# EAGLE design Hydrometer (EAGLE 7.5.0)
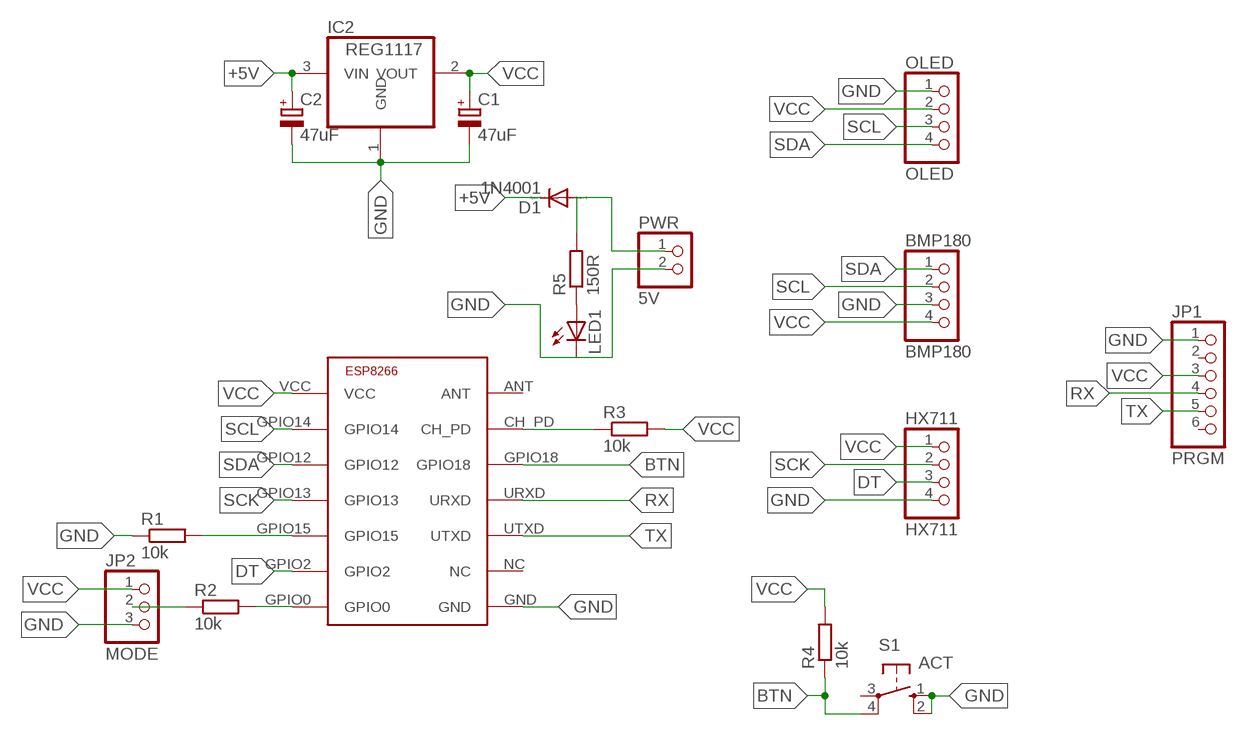
[diagram p0: schematic, sheet 1]

## Parts
BMP180  BMP180  PINHD-1X4  [1X04]
C1  47uF  CPOL-EUE2-5  [E2-5]
C2  47uF  CPOL-EUE2.5-5  [E2,5-5]
D1  1N4001  1N4004  [DO41-10]
HX711  HX711  PINHD-1X4  [1X04]
IC2  REG1117  [SOT223]
JP1  PRGM  PINHD-1X6  [1X06]
JP2  MODE  PINHD-1X3  [1X03]
LED1  LED3MM  [LED3MM]
OLED  OLED  PINHD-1X4  [1X04]
PWR  5V  PINHD-1X2  [1X02]
R1  10k  R-EU_R1206  [R1206]
R2  10k  R-EU_0204/7  [0204/7]
R3  10k  R-EU_R1206  [R1206]
R4  10k  R-EU_R1206  [R1206]
R5  150R  R-EU_0204/7  [0204/7]
S1  ACT  10-XX  [B3F-10XX]
U$1  ESP8266-03  [ESP-03]

## Nets
+5V: C2.+ D1.C IC2.3(VIN)
BTN: R4.1 S1.4(P1) U$1.GPIO18
DT: HX711.3 U$1.GPIO2
DTR: R2.2 U$1.GPIO0
GND: BMP180.3 C1.- C2.- HX711.4 IC2.1(GND) JP1.1 JP2.3 LED1.K(C) OLED.1 PWR.2 R1.1 S1.1(S) S1.2(S1) U$1.GND
N$2: JP2.2 R2.1
N$3: R1.2 U$1.GPIO15
N$4: D1.A PWR.1 R5.2
N$5: R3.1 U$1.CH_PD
N$8: LED1.A R5.1
RX: JP1.4 U$1.URXD
SCK: HX711.2 U$1.GPIO13
SCL: BMP180.2 OLED.3 U$1.GPIO14
SDA: BMP180.1 OLED.4 U$1.GPIO12
TX: JP1.5 U$1.UTXD
VCC: BMP180.4 C1.+ HX711.1 IC2.2(VOUT) JP1.3 JP2.1 OLED.2 R3.2 R4.2 U$1.VCC
Unconnected: JP1.2 JP1.6 S1.3(P) U$1.ANT U$1.NC

## Library data of the parts
BMP180 HX711 OLED = pinhead:PINHD-1X4: PIN HEADER
C1 C2 = resistor:CPOL-EU: POLARIZED CAPACITOR, European symbol
D1 = diode:1N4004: DIODE general purpose rectifier, 1 A
IC2 = burr-brown:REG1117: 800mA and 1A Low Dropout (LDO) Positive Regulator 1.8V, 2.5V, 2.85V, 3.3V, 5V, and Adj; MPN: REG1117; OC_FARNELL: 1097566; OC_NEWARK: 14P6981
JP1 = pinhead:PINHD-1X6: PIN HEADER
JP2 = pinhead:PINHD-1X3: PIN HEADER
LED1 = led:LED: LED OSRAM: - CHIPLED LG R971, LG N971, LY N971, LG Q971, LY Q971, LO R971, LY R971 LH N974, LH R974 LS Q976, LO Q976, LY Q976 LO Q996 - Hyper CHIPLED LW Q18S LB Q993, LB Q99A, LB R99A - SideLED LS A670, LO A670, LY A670, LG A670, LP A670 LB A673, LV A673, LT A673, LW A673 LH A674 LY A675 LS A676, LA A676, LO A676, LY A676, LW A676 LS A679, LY A679, LG A679 - Hyper Micro SIDELED® LS Y876, LA Y876, LO Y876, LY Y876 LT Y87S - SmartLED LW L88C, LW L88S LB L89C, LB L89S, LG L890 LS L89K, LO L89K, LY L89K LS L896, LA L896, LO L896, LY L896 - TOPLED LS T670, LO T670, LY T670, LG T670, LP T670 LSG T670, LSP T670, LSY T670, LOP T670, LYG T670 LG T671, LOG T671, LSG T671 LB T673, LV T673, LT T673, LW T673 LH T674 LS T676, LA T676, LO T676, LY T676, LB T676, LH T676, LSB T676, LW T676 LB T67C, LV T67C, LT T67C, LS T67K, LO T67K, LY T67K, LW E67C LS E67B, LA E67B, LO E67B, LY E67B, LB E67C, LV E67C, LT E67C LW T67C LS T679, LY T679, LG T679 LS T770, LO T770, LY T770, LG T770, LP T770 LB T773, LV T773, LT T773, LW T773 LH T774 LS E675, LA E675, LY E675, LS T675 LS T776, LA T776, LO T776, LY T776, LB T776 LHGB T686 LT T68C, LB T68C - Hyper Mini TOPLED® LB M676 - Mini TOPLED Santana® LG M470 LS M47K, LO M47K, LY M47K Source: http://www.osram.convergy.de LUXEON: - LUMILED® LXK2-PW12-R00, LXK2-PW12-S00, LXK2-PW14-U00, LXK2-PW14-V00 LXK2-PM12-R00, LXK2-PM12-S00, LXK2-PM14-U00 LXK2-PE12-Q00, LXK2-PE12-R00, LXK2-PE12-S00, LXK2-PE14-T00, LXK2-PE14-U00 LXK2-PB12-K00, LXK2-PB12-L00, LXK2-PB12-M00, LXK2-PB14-N00, LXK2-PB14-P00, LXK2-PB14-Q00 LXK2-PR12-L00, LXK2-PR12-M00, LXK2-PR14-Q00, LXK2-PR14-R00 LXK2-PD12-Q00, LXK2-PD12-R00, LXK2-PD12-S00 LXK2-PH12-R00, LXK2-PH12-S00 LXK2-PL12-P00, LXK2-PL12-Q00, LXK2-PL12-R00 Source: www.luxeon.com KINGBRIGHT: KA-3528ASYC Source: www.kingbright.com
PWR = pinhead:PINHD-1X2: PIN HEADER
R1-R5 = resistor:R-EU_: RESISTOR, European symbol
S1 = switch-omron:10-XX: OMRON SWITCH; MPN: B3F-1000; OC_FARNELL: 176432; OC_NEWARK: 36M3542
U$1 = ESP8200:ESP8266-03: ESP8266 - ESP-03 Module

## Net classes
0 default: width 0.001 mm

## Board
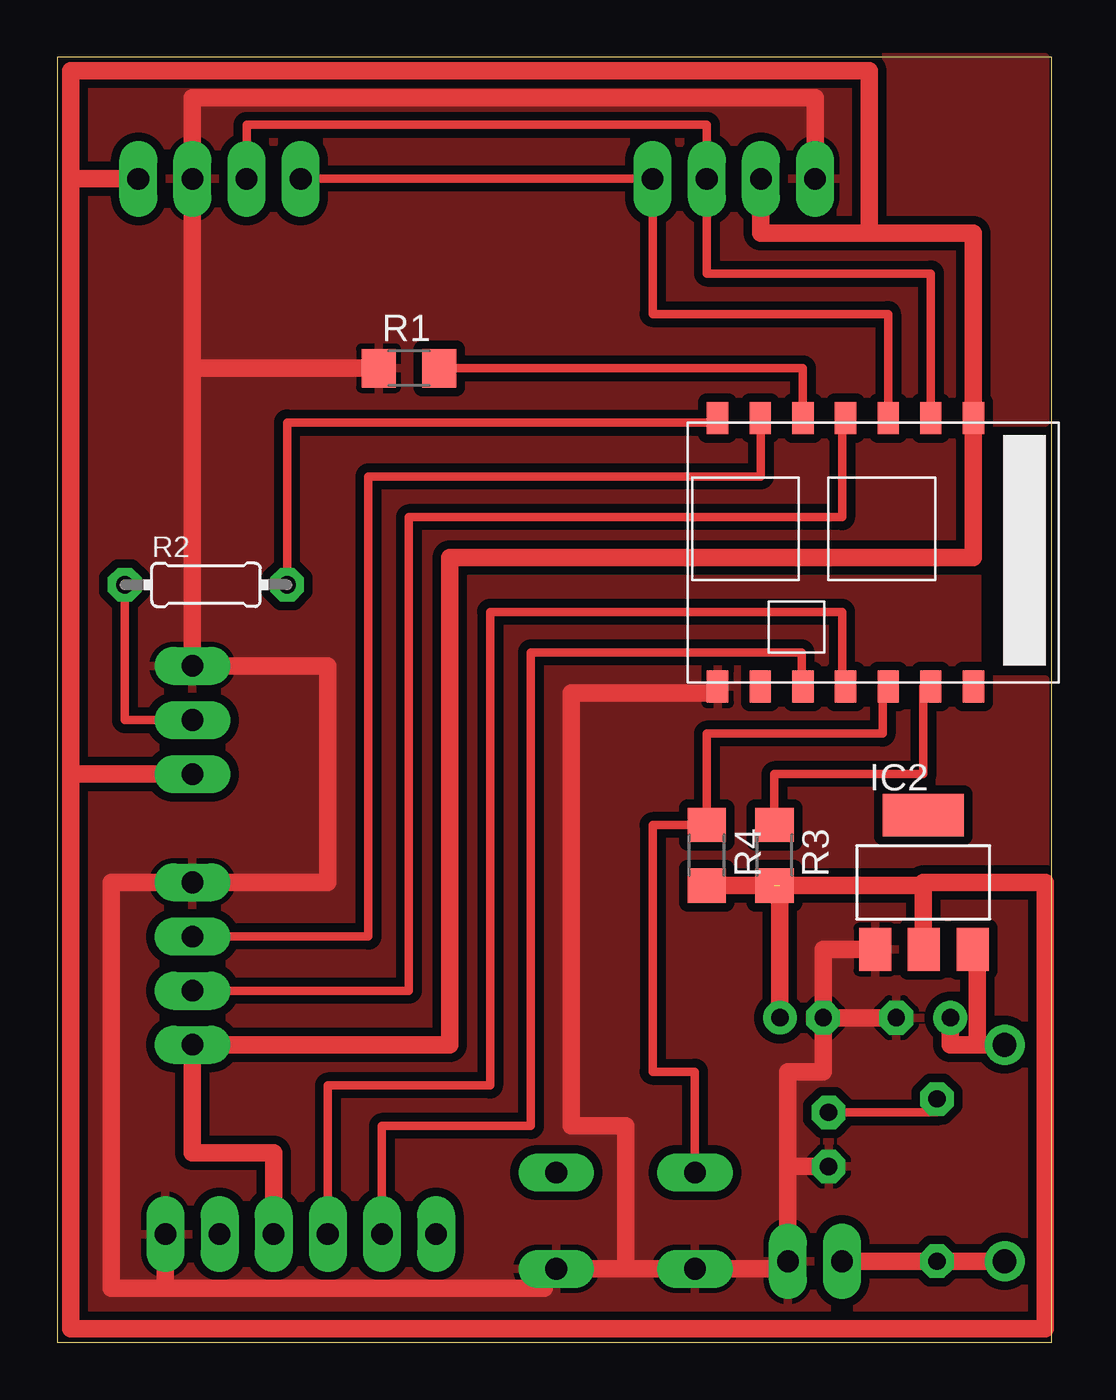
[diagram p1: board, top side]
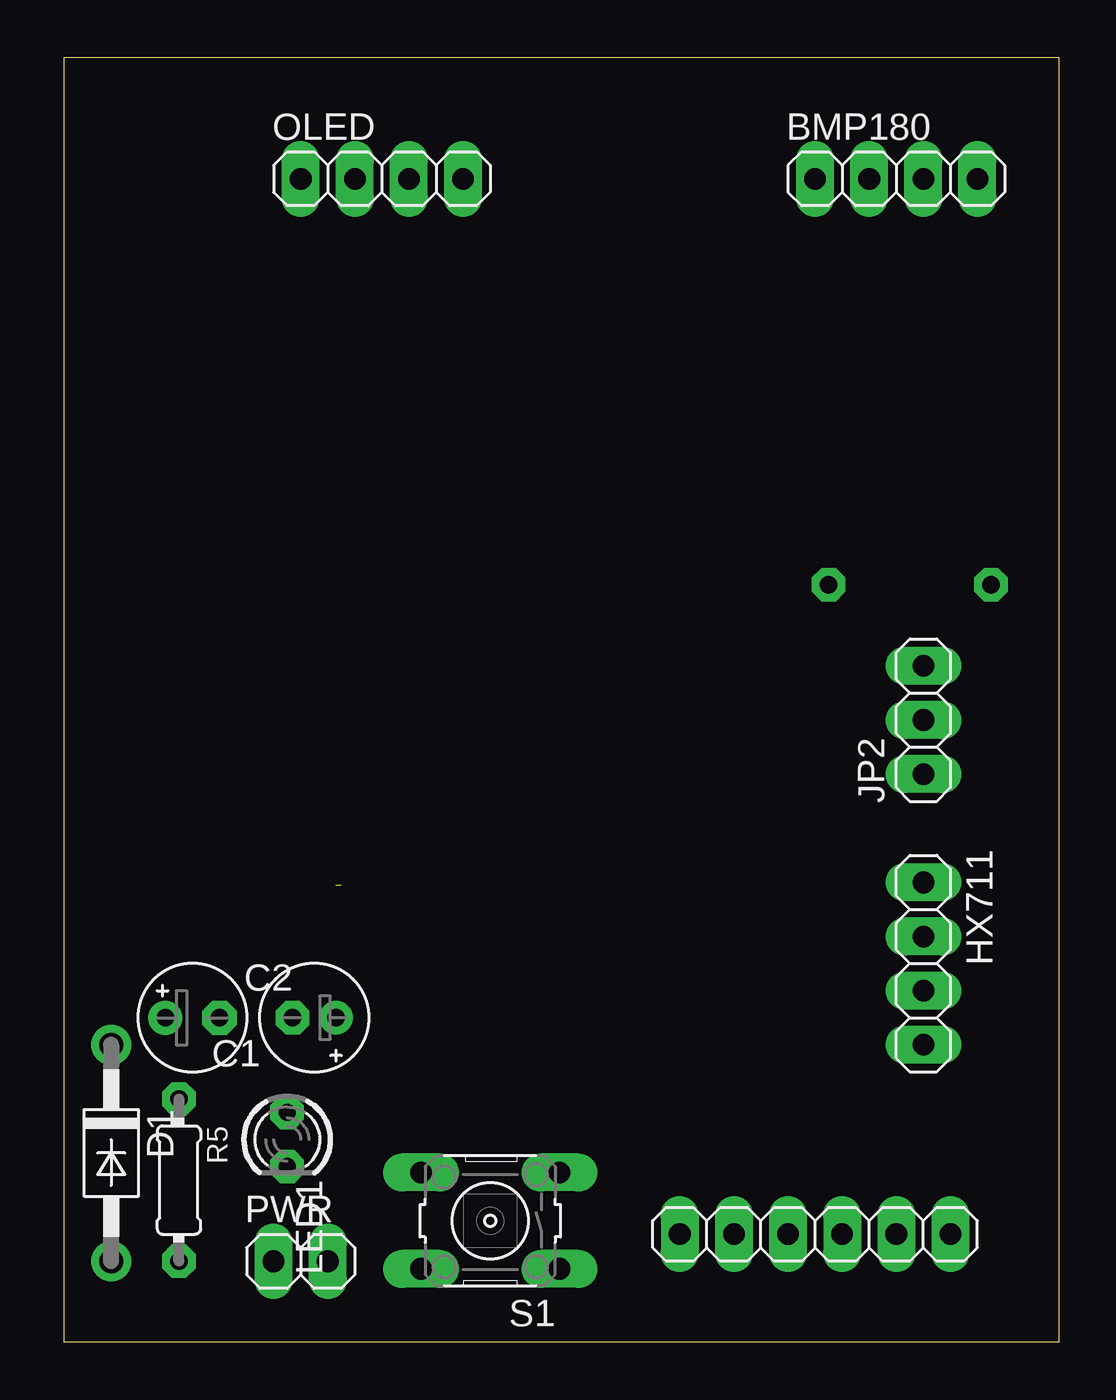
[diagram p2: board, bottom side, seen from below]

Size 46.66 x 60.31 mm. Coordinates in mm from the lower left corner, seen from the top.
Outline: 0,0 46.66,0 46.66,60.31 0,60.31 0,0
Copper layers (1*16): Top 0.035mm / dielectric 1.5mm / Bottom 0.035mm
Design rules "default": minimum track width 16mil, minimum drill 0.8mm, track to track 8mil, track to pad 8mil, pad to pad 8mil, via to via 8mil, smd to smd 8mil, copper to edge 0mil, drill to drill 8mil, minimum pad ring 15mil, minimum via ring 15mil, stop-mask expansion 4mil, vias tented up to drill 0mil, thermal gap 10mil

### Footprints (pad centres in the part's own frame; a part is rotated, then mirrored left to right if it is on the bottom)
1X04 = drill 1.016 long: 1 -3.81,0; 2 -1.27,0; 3 1.27,0; 4 3.81,0
E2-5 = drill 0.813 pad 1.27: + -1.016,0 | drill 0.813 pad 1.27 octagon: - 1.016,0
E2,5-5 = drill 0.813 pad 1.6: + -1.27,0 | drill 0.813 pad 1.6 octagon: - 1.27,0
DO41-10 = drill 1.118: A 5.08,0; C -5.08,0
SOT223 = smd 1.499 x 2.007: 1 -2.261,-3.15; 2 0.025,-3.15; 3 2.311,-3.15 | smd 3.81 x 2.007: 4 0,3.15
1X06 = drill 1.016 long: 1 -6.35,0; 2 -3.81,0; 3 -1.27,0; 4 1.27,0; 5 3.81,0; 6 6.35,0
1X03 = drill 1.016 long: 1 -2.54,0; 2 0,0; 3 2.54,0
LED3MM = drill 0.813 octagon: A -1.27,0; K 1.27,0
1X02 = drill 1.016 long: 1 -1.27,0; 2 1.27,0
R1206 = smd 1.6 x 1.803: 1 -1.422,0; 2 1.422,0
0204/7 = drill 0.813 octagon: 1 -3.81,0; 2 3.81,0
B3F-10XX = drill 1.016 long: 1 -3.251,2.261; 2 3.251,2.261; 3 -3.251,-2.261; 4 3.251,-2.261
ESP-03 = smd 1 x 1.5: ANT 4,12.4; CH_PD 6,12.4; GND 16,12.4; GPIO0 16,-0.2; GPIO2 14,-0.2; GPIO12 8,-0.2; GPIO13 10,-0.2; GPIO14 6,-0.2; GPIO15 12,-0.2; GPIO18 8,12.4; NC 14,12.4; URXD 10,12.4; UTXD 12,12.4; VCC 4,-0.2

### Placement (x,y rotation side)
BMP180  7.62,54.61 0 bottom
C1  34.92,15.24 180 bottom
C2  40.64,15.24 0 bottom
D1  44.45,8.89 270 bottom
HX711  6.35,17.78 90 bottom
IC2  40.64,21.59 0 top
JP1  11.43,5.08 180 bottom
JP2  6.35,29.21 90 bottom
LED1  36.2,9.53 270 bottom
OLED  31.75,54.61 0 bottom
PWR  35.56,3.81 0 bottom
R1  16.51,45.72 0 top
R2  6.99,35.56 0 top
R3  33.66,22.86 270 top
R4  30.48,22.86 270 top
R5  41.27,7.62 270 bottom
S1  26.67,5.71 180 bottom
U$1  46.99,43.18 180 top

### Tracks (layer width: path | path; a pad name or v marks a point on that pad's centre or on a via)
+5V
  Top 0.813: C2.+ 41.91,13.97 43.18,13.97 | IC2.3 43.18,18.44 43.18,13.97 | 43.18,13.97 D1.C
BTN
  Top 0.406: U$1.GPIO18 38.73,30.78 38.73,28.57 30.48,28.57 R4.1 27.94,24.28 27.94,12.7 29.92,12.7 S1.4
DT
  Top 0.406: U$1.GPIO2 33.02,43.38 33.02,40.64 14.61,40.64 14.61,19.05 HX711.3
DTR
  Top 0.406: R2.2 10.79,43.18 30.99,43.18 U$1.GPIO0
GND
  Top 0.813: S1.2 26.67,3.45 | 26.67,3.45 S1.1 22.86,3.45 22.86,2.54 5.08,2.54 | 5.08,2.54 JP1.1 | 5.08,2.54 2.54,2.54 2.54,21.59 HX711.4 12.7,21.59 12.7,31.75 JP2.3 6.35,45.72 | OLED.1 35.56,58.42 6.35,58.42 BMP180.3 6.35,45.72 | 26.67,3.45 26.67,10.16 24.13,10.16 24.13,30.48 30.99,30.48 U$1.GND | 29.92,3.81 S1.2 | S1.2 34.29,3.45 PWR.2 34.29,12.7 35.94,12.7 C1.- | 34.29,8.26 LED1.K | C1.- C2.- | IC2.1 35.94,18.44 C1.- | 6.35,45.72 R1.1
  pour Top (isolate 0.406): 0,60.33 46.35,60.33 46.35,43.18 43.18,43.18 43.18,31.11 46.35,31.11 46.35,0 0,0
N$1
  pour Top (isolate 0.406): 0,0 0,60.33 46.35,60.33 46.35,43.18 43.18,43.18 43.18,31.11 46.35,31.11 46.35,0
N$2
  Top 0.406: R2.1 3.17,29.21 JP2.2
N$3
  Top 0.406: R1.2 34.99,45.72 U$1.GPIO15
N$4
  Top 0.813: PWR.1 R5.2 D1.A
N$5
  Top 0.406: U$1.CH_PD 40.64,30.78 40.64,26.67 33.66,26.67 R3.1
N$8
  Top 0.406: LED1.A 41.27,10.79 R5.1
RX
  Top 0.406: U$1.URXD 36.83,30.78 36.83,34.29 20.32,34.29 20.32,12.06 12.7,12.06 JP1.4
SCK
  Top 0.406: U$1.GPIO13 36.83,43.38 36.83,38.73 16.51,38.73 16.51,16.51 HX711.2
SCL
  Top 0.406: U$1.GPIO14 40.99,50.16 30.48,50.16 OLED.3 30.48,57.15 8.89,57.15 BMP180.2
SDA
  Top 0.406: U$1.GPIO12 38.99,48.26 27.94,48.26 OLED.4 BMP180.1
TX
  Top 0.406: U$1.UTXD 34.92,30.78 34.92,32.38 22.23,32.38 22.23,10.16 15.24,10.16 JP1.5
VCC  (1 unrouted)
  Top 0.813: JP1.3 10.16,8.89 6.35,8.89 HX711.1 18.41,13.97 18.41,36.83 42.99,36.83 U$1.VCC 42.99,52.07 38.1,52.07 | 2.54,54.61 BMP180.4 0.64,54.61 | 0.64,26.67 JP2.1 | OLED.2 33.02,52.07 38.1,52.07 | 38.1,52.07 38.1,59.69 0.64,59.69 0.64,54.61 | 0.64,54.61 0.64,26.67 | 0.64,26.67 0.64,0.64 46.35,0.64 46.35,21.59 40.64,21.59 40.64,21.44 | IC2.2 40.64,18.44 40.64,21.44 | R3.2 40.64,21.44 | R4.2 33.91,21.44 C1.+

### Text on the board
tValues: GND / VCC / SCL / SDA | SDA / SCL / GND / VCC | PGM / / RUN | GND / DT / SCK / VCC | TX / RX / VCC / / GND